# EAGLE design Attempt1 (EAGLE 9.6.2)
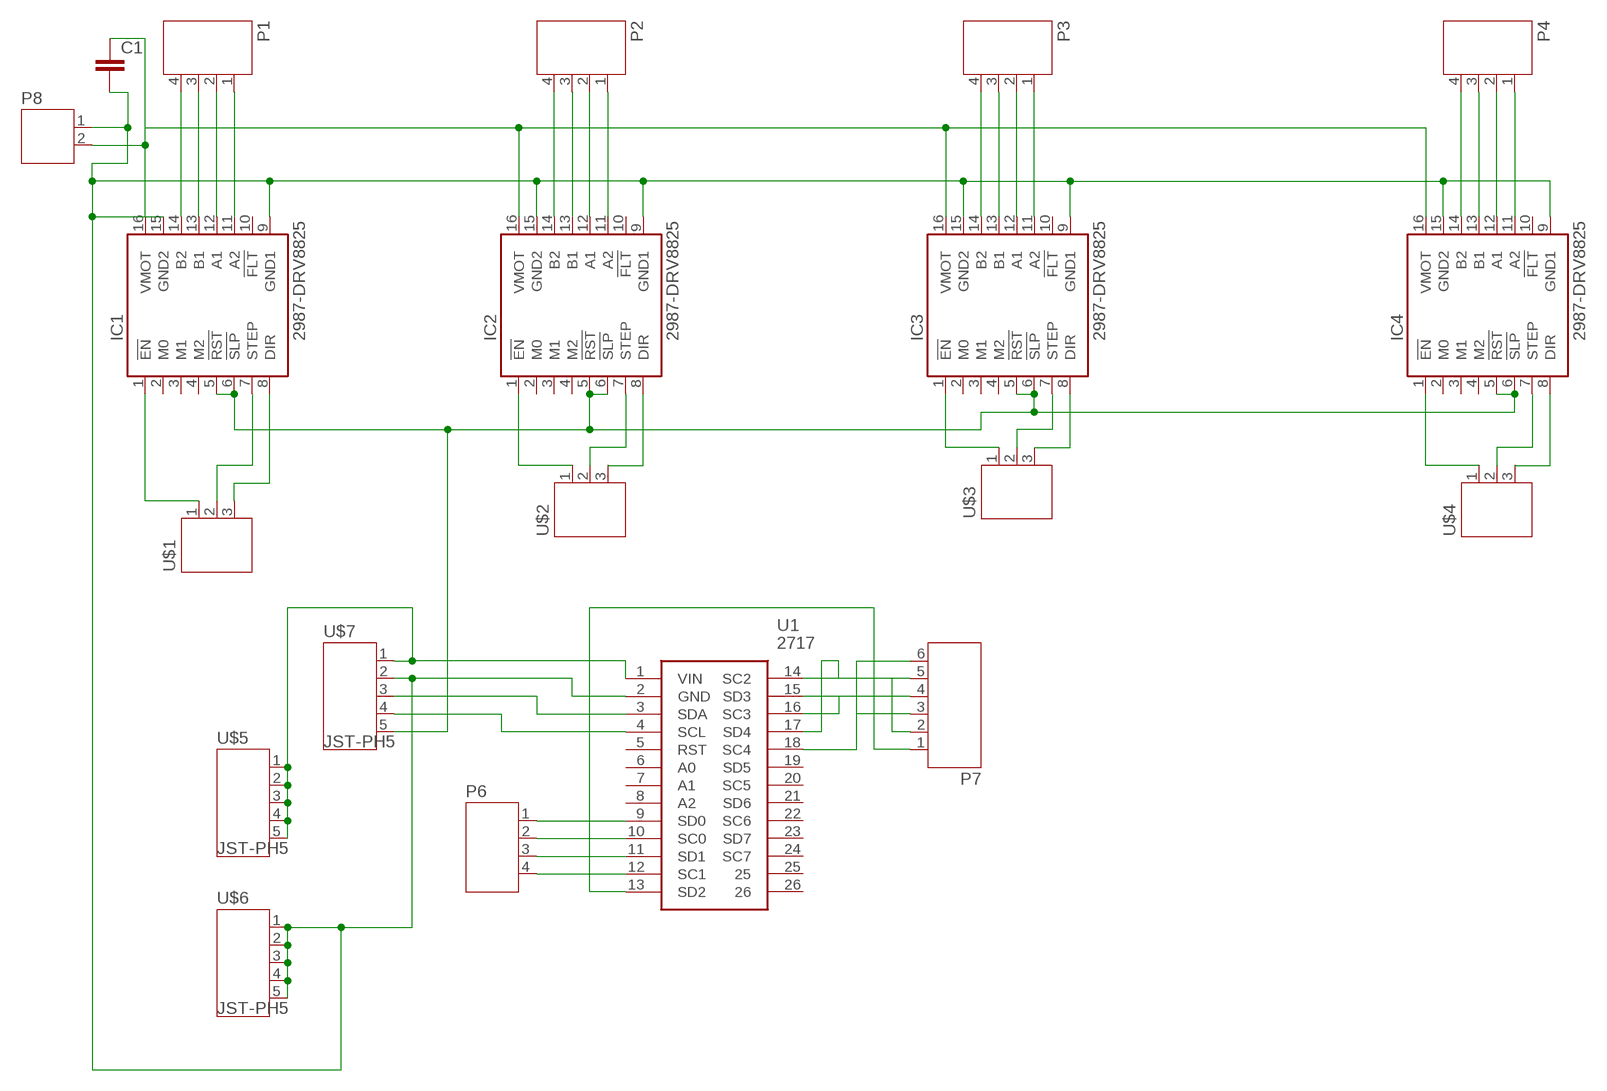
[diagram p0: schematic, sheet 1]

## Parts
C1  C2.5/4  [C2.5-4]
IC1  2987-DRV8825  [DRV8825]
IC2  2987-DRV8825  [DRV8825]
IC3  2987-DRV8825  [DRV8825]
IC4  2987-DRV8825  [DRV8825]
P1  JST-PH4  [JST-PH4]
P2  JST-PH4  [JST-PH4]
P3  JST-PH4  [JST-PH4]
P4  JST-PH4  [JST-PH4]
P6  JST-PH4  [JST-PH4]
P7  JST-PH6  [JST-PH6]
P8  JST-PH2  [JST-PH2]
U1  2717  [2717]
U$1  JST-PH3  [JST-PH3]
U$2  JST-PH3  [JST-PH3]
U$3  JST-PH3  [JST-PH3]
U$4  JST-PH3  [JST-PH3]
U$5  JST-PH5  [JST-PH5]
U$6  JST-PH5  [JST-PH5]
U$7  JST-PH5  [JST-PH5]

## Nets
N$1: IC1.14(B2) P1.4
N$2: IC1.13(B1) P1.3
N$3: IC1.12(A1) P1.2
N$4: IC1.11(A2) P1.1
N$5: IC2.14(B2) P2.4
N$6: IC2.13(B1) P2.3
N$7: IC2.12(A1) P2.2
N$8: IC2.11(A2) P2.1
N$9: IC3.11(A2) P3.1
N$10: IC3.12(A1) P3.2
N$11: IC3.13(B1) P3.3
N$12: IC3.14(B2) P3.4
N$13: IC4.14(B2) P4.4
N$14: IC4.13(B1) P4.3
N$15: IC4.12(A1) P4.2
N$16: IC4.11(A2) P4.1
N$17: IC4.8(DIR) U$4.3
N$18: IC4.7(STEP) U$4.2
N$19: IC4.1(!EN) U$4.1
N$20: IC1.5(!RST) IC1.6(!SLP) IC2.5(!RST) IC2.6(!SLP) IC3.5(!RST) IC3.6(!SLP) IC4.5(!RST) IC4.6(!SLP) U$7.5
N$21: P7.2 U1.14(SC2)
N$22: IC3.8(DIR) U$3.3
N$23: IC3.7(STEP) U$3.2
N$24: IC3.1(!EN) U$3.1
N$25: IC2.8(DIR) U$2.3
N$26: IC2.7(STEP) U$2.2
N$27: IC2.1(!EN) U$2.1
N$28: P7.3 U1.15(SD3)
N$29: C1.1 IC1.16(VMOT) IC2.16(VMOT) IC3.16(VMOT) IC4.16(VMOT) P8.2
N$30: IC1.8(DIR) U$1.3
N$31: IC1.7(STEP) U$1.2
N$32: IC1.1(!EN) U$1.1
N$33: P7.4 U1.16(SC3)
N$34: C1.2 IC1.9(GND1) IC1.15(GND2) IC2.9(GND1) IC2.15(GND2) IC3.9(GND1) IC3.15(GND2) IC4.9(GND1) IC4.15(GND2) P8.1 U1.2(GND) U$6.1 U$6.2 U$6.3 U$6.4 U$6.5 U$7.2
N$35: P6.1 U1.9(SD0)
N$36: P6.2 U1.10(SC0)
N$37: P6.3 U1.11(SD1)
N$38: P6.4 U1.12(SC1)
N$39: P7.5 U1.17(SD4)
N$40: P7.6 U1.18(SC4)
N$44: P7.1 U1.13(SD2)
N$47: U1.3(SDA) U$7.3
N$48: U1.4(SCL) U$7.4
N$49: U1.1(VIN) U$5.1 U$5.2 U$5.3 U$5.4 U$5.5 U$7.1
Unconnected: IC1.2(M0) IC1.3(M1) IC1.4(M2) IC1.10(!FLT) IC2.2(M0) IC2.3(M1) IC2.4(M2) IC2.10(!FLT) IC3.2(M0) IC3.3(M1) IC3.4(M2) IC3.10(!FLT) IC4.2(M0) IC4.3(M1) IC4.4(M2) IC4.10(!FLT) U1.5(RST) U1.6(A0) U1.7(A1) U1.8(A2) U1.19(SD5) U1.20(SC5) U1.21(SD6) U1.22(SC6) U1.23(SD7) U1.24(SC7) U1.25 U1.26

## Library data of the parts
C1 = capacitor-wima:C: CAPACITOR naming: grid - package width
IC1-IC4 = pololu-stepper-driver:2987-DRV8825: DRV8825 Stepper Motor Driver Carrier; High Current (Bulk; Header Pins Soldered) #2987 DRV8825 Stepper Motor Driver Carrier; High Current (Bulk; Header Pins Soldered) <https://www.pololu.com/product/2987> in Japan, Suzaku Lab. Ltd. <https://suzakugiken.jp/> #2987 DRV8825 大電流ステッピングモータドライバボード (バルク品 ピンヘッダ実装済み) <https://szc.jp/po2987>
P1-P4 P6 = jst-ph-k:JST-PH4
P7 = jst-ph-k:JST-PH6
P8 = jst-ph-k:JST-PH2
U1 = TCA9548A_m:2717: Switch IC Development Tools TCA9548A I2C Multiplexer Source: Datasheet <https://learn.adafruit.com/downloads/pdf/adafruit-tca9548a-1-to-8-i2c-multiplexer-breakout.pdf>; DESCRIPTION: Switch IC Development Tools TCA9548A I2C Multiplexer; HEIGHT: 1mm; MANUFACTURER_NAME: Adafruit; MANUFACTURER_PART_NUMBER: 2717; MOUSER_PART_NUMBER: 485-2717; MOUSER_PRICE-STOCK: https://www.mouser.com/Search/Refine.aspx?Keyword=485-2717
U$1-U$4 = jst-ph-k:JST-PH3
U$5-U$7 = jst-ph-k:JST-PH5

## Board
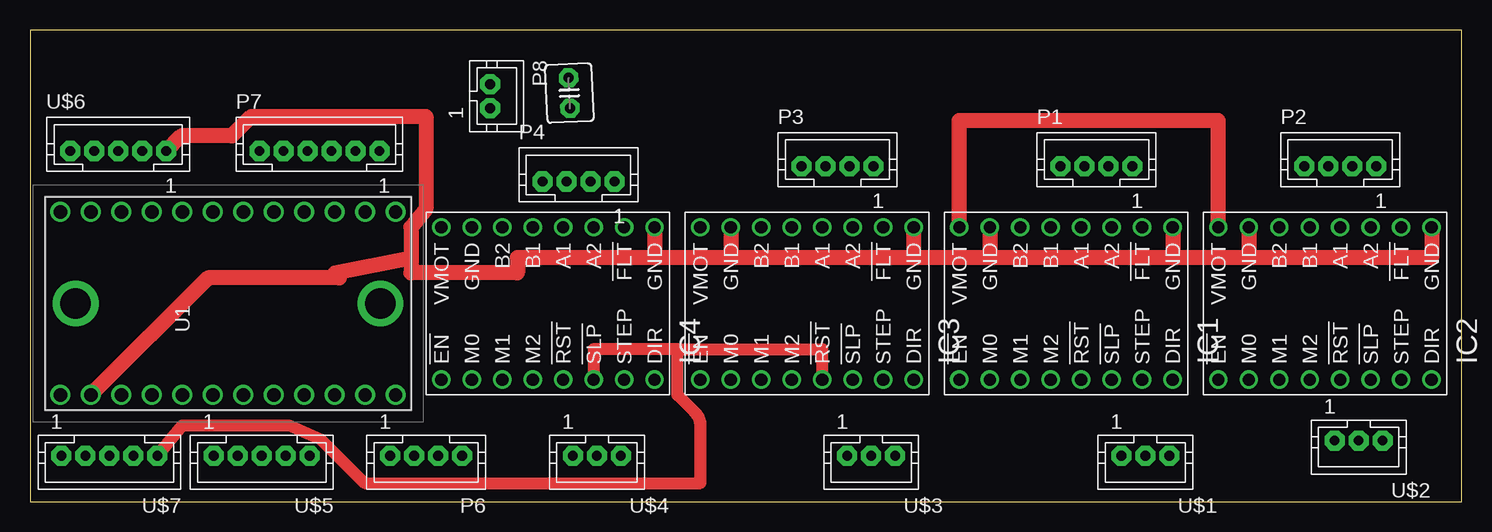
[diagram p1: board, top side]
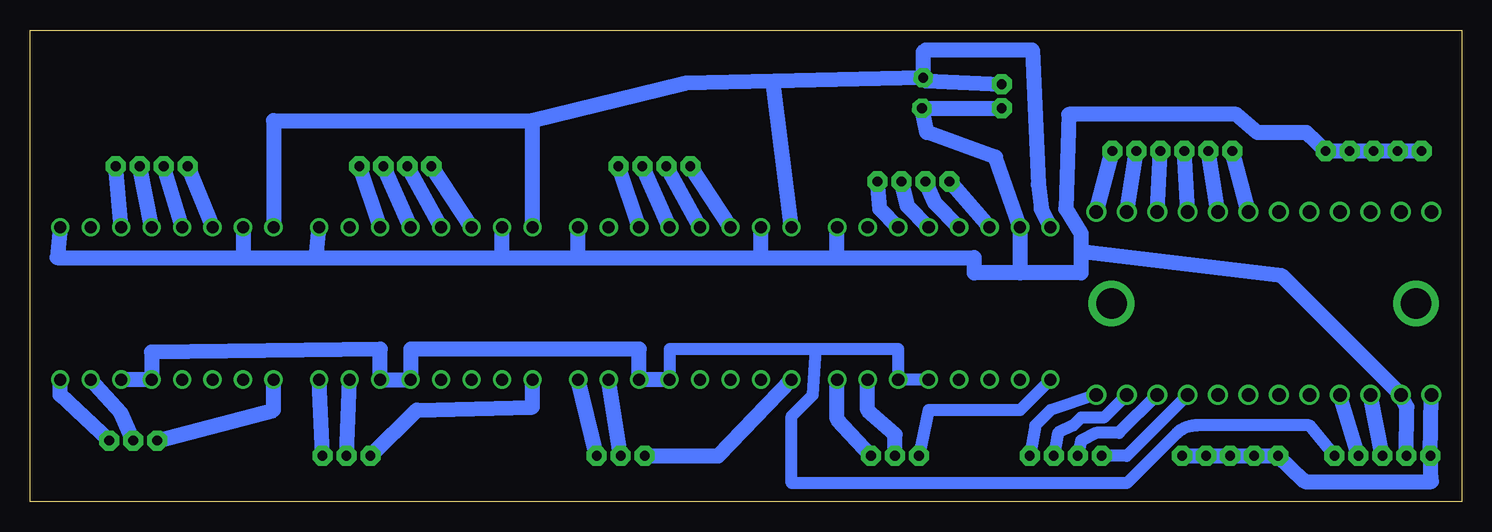
[diagram p2: board, bottom side, seen from below]

Size 119.36 x 39.29 mm. Coordinates in mm from the lower left corner, seen from the top.
Outline: 0,0 119.36,0 119.36,39.29 0,39.29 0,0
Copper layers (1*16): Top 0.035mm / dielectric 1.5mm / Bottom 0.035mm
Design rules "default": minimum track width 6mil, minimum drill 0.35mm, track to track 6mil, track to pad 6mil, pad to pad 6mil, via to via 6mil, smd to smd 6mil, copper to edge 40mil, drill to drill 6mil, minimum pad ring 10mil, minimum via ring 8mil, stop-mask expansion 4mil, vias tented up to drill 0mil, thermal gap 10mil

### Footprints (pad centres in the part's own frame; a part is rotated, then mirrored left to right if it is on the bottom)
C2.5-4 = drill 0.813 pad 1.6 octagon: 1 -1.27,0; 2 1.27,0
DRV8825 = drill 1.016: 1 -6.35,8.89; 2 -6.35,6.35; 3 -6.35,3.81; 4 -6.35,1.27; 5 -6.35,-1.27; 6 -6.35,-3.81; 7 -6.35,-6.35; 8 -6.35,-8.89; 9 6.35,-8.89; 10 6.35,-6.35; 11 6.35,-3.81; 12 6.35,-1.27; 13 6.35,1.27; 14 6.35,3.81; 15 6.35,6.35; 16 6.35,8.89
JST-PH4 = drill 0.813 pad 1.676 octagon: 1 3,0; 2 1,0; 3 -1,0; 4 -3,0
JST-PH6 = drill 0.813 pad 1.676 octagon: 1 5,0; 2 3,0; 3 1,0; 4 -1,0; 5 -3,0; 6 -5,0
JST-PH2 = drill 0.813 pad 1.676 octagon: 1 1,0; 2 -1,0
2717 = drill 1.11 pad 1.665: 1 -7.62,13.97; 2 -7.62,11.43; 3 -7.62,8.89; 4 -7.62,6.35; 5 -7.62,3.81; 6 -7.62,1.27; 7 -7.62,-1.27; 8 -7.62,-3.81; 9 -7.62,-6.35; 10 -7.62,-8.89; 11 -7.62,-11.43; 12 -7.62,-13.97; 13 7.62,-13.97; 14 7.62,-11.43; 15 7.62,-8.89; 16 7.62,-6.35; 17 7.62,-3.81; 18 7.62,-1.27; 19 7.62,1.27; 20 7.62,3.81; 21 7.62,6.35; 22 7.62,8.89; 23 7.62,11.43; 24 7.62,13.97 | drill 2.54 pad 3.81: 25 0,12.7; 26 0,-12.7
JST-PH3 = drill 0.813 pad 1.676 octagon: 1 3,0; 2 1,0; 3 -1,0
JST-PH5 = drill 0.813 pad 1.676 octagon: 1 5,0; 2 3,0; 3 1,0; 4 -1,0; 5 -3,0

### Placement (x,y rotation side)
C1  44.96,34.04 272.6 top
IC1  86.36,16.51 90 top
IC2  107.95,16.51 90 top
IC3  64.77,16.51 90 top
IC4  43.18,16.51 90 top
P1  88.9,27.94 0 top
P2  109.22,27.94 0 top
P3  67.31,27.94 0 top
P4  45.72,26.67 0 top
P6  33.02,3.81 180 top
P7  24.13,29.21 0 top
P8  38.35,33.78 270 top
U1  16.51,16.51 90 top
U$1  93.98,3.81 180 top
U$2  111.76,5.08 180 top
U$3  71.12,3.81 180 top
U$4  48.26,3.81 180 top
U$5  20.32,3.81 180 top
U$6  6.35,29.21 0 top
U$7  7.62,3.81 180 top

### Tracks (layer width: path | path; a pad name or v marks a point on that pad's centre or on a via)
N$1
  Bottom 1.27: IC1.14 P1.4
N$2
  Bottom 1.27: IC1.13 P1.3
N$3
  Bottom 1.27: IC1.12 P1.2
N$4
  Bottom 1.27: IC1.11 P1.1
N$5
  Bottom 1.27: P2.4 IC2.14
N$6
  Bottom 1.27: IC2.13 P2.3
N$7
  Bottom 1.27: IC2.12 P2.2
N$8
  Bottom 1.27: IC2.11 P2.1
N$9
  Bottom 1.27: IC3.11 P3.1
N$10
  Bottom 1.27: IC3.12 P3.2
N$11
  Bottom 1.27: IC3.13 P3.3
N$12
  Bottom 1.27: IC3.14 P3.4
N$13
  Bottom 1.27: IC4.14 P4.4
N$14
  Bottom 1.27: IC4.13 43.94,24.89 P4.3
N$15
  Bottom 1.27: IC4.12 46.23,24.64 P4.2
N$16
  Bottom 1.27: IC4.11 48.51,24.38 P4.1
N$17
  Bottom 1.27: U$4.3 52.07,6.86 IC4.8
N$18
  Bottom 1.27: U$4.2 47.24,5.59 49.53,7.62 IC4.7
N$19
  Bottom 1.016: IC4.1 36.83,7.62 44.45,7.62 U$4.1
N$20
  Top 1.016: U$7.5 12.7,6.35 21.59,6.35 24.24,5.19 27.91,1.52 55.88,1.52 55.88,6.35 arc45 55.43,7.43 53.98,8.89 53.98,12.7 | 53.98,12.7 46.99,12.7 IC4.6 | 53.98,12.7 66.04,12.7 IC3.5
  Bottom 1.016: U$7.5 12.7,6.35 22.06,6.35 arc-45 23.86,5.61 27.94,1.52 55.88,1.52 55.88,7.11 54.1,8.89 53.85,12.7 | 53.85,12.7 46.99,12.7 IC4.6 IC4.5 | 53.85,12.7 66.04,12.7 IC3.5
  Bottom 1.27: IC3.5 IC3.6 68.58,12.7 87.63,12.7 IC1.5 IC1.6 90.17,12.7 109.22,12.45 IC2.5 IC2.6
N$21
  Bottom 1.27: U1.14 P7.2
N$22
  Bottom 1.27: U$3.3 IC3.8
N$23
  Bottom 1.27: U$3.2 IC3.7
N$24
  Bottom 1.27: U$3.1 61.98,3.81 IC3.1
N$25
  Bottom 1.27: U$2.3 116.84,8.89 IC2.8
N$26
  Bottom 1.27: U$2.2 111.76,7.37 IC2.7
N$27
  Bottom 1.27: U$2.1 99.06,7.62 IC2.1
N$28
  Bottom 1.27: U1.15 P7.3
N$29
  Top 1.27: IC2.16 99.06,31.75 77.47,31.75 IC1.16
  Bottom 1.27: IC1.16 77.47,31.75 | 77.47,31.75 99.06,31.75 IC2.16 | C1.1 57.41,35.02 | 57.41,35.02 64.78,34.84 64.99,34.79 77.47,31.75 | C1.1 44.66,35.06 P8.2 | C1.1 44.9,37.45 44.7,37.64 35.81,37.64 35.31,26.42 35.05,24.38 IC4.16 | IC3.16 57.41,35.02
N$30
  Bottom 1.27: U$1.3 IC1.8
N$31
  Bottom 1.27: U$1.2 IC1.7
N$32
  Bottom 1.27: U$1.1 87.12,7.62 77.47,7.87 IC1.1
N$33
  Bottom 1.27: U1.16 P7.4
N$34
  Top 1.27: IC2.9 116.84,20.32 101.6,20.32 | IC2.15 101.6,20.32 | 101.6,20.32 95.25,20.32 | 95.25,20.32 80.01,20.32 | IC1.9 95.25,20.32 | IC1.15 80.01,20.32 | IC3.15 58.42,20.32 | 80.01,20.32 73.66,20.32 | 73.66,20.32 58.42,20.32 | IC3.9 73.66,20.32 | IC4.9 52.07,20.32 | 58.42,20.32 52.07,20.32 | 52.07,20.32 40.64,20.32 40.64,19.05 31.75,19.05 31.75,20.32 | U1.2 14.83,18.64 25.8,18.64 25.4,19.05 31.75,20.32 | U$6.1 12.62,30.48 16.83,30.48 18.46,32.11 33.02,32.11 33.02,24.38 31.75,22.86 31.75,20.32
  Bottom 1.27: U$7.2 4.57,7.87 U1.2 14.99,18.8 31.75,20.83 | U$6.5 U$6.4 U$6.3 U$6.2 U$6.1 12.95,30.73 17.02,30.73 18.8,32.26 32.77,32.26 33.02,24.38 31.75,22.35 31.75,20.83 | 31.75,20.83 31.75,19.05 36.83,19.05 | 36.83,19.05 40.64,19.05 40.64,20.32 52.07,20.32 | 101.6,20.32 117.09,20.32 IC2.9 | 101.6,20.32 95.5,20.32 | 95.5,20.32 80.01,20.32 | 80.01,20.32 73.66,20.32 | 73.66,20.32 58.42,20.32 | 58.42,20.32 52.07,20.32 | IC2.15 101.6,20.32 | 95.5,20.32 IC1.9 | 80.01,20.32 IC1.15 | 73.66,20.32 IC3.9 | 58.42,20.32 IC3.15 | 52.07,20.32 IC4.9 | 38.38,32.8 P8.1 38.69,32.77 C1.2 44.61,30.75 38.86,28.7 IC4.15 36.83,19.05
N$35
  Bottom 1.016: U1.9 27.94,3.81 P6.1
N$36
  Bottom 1.016: U1.10 28.57,5.71 30.48,5.71 31.75,5.08 P6.2
N$37
  Bottom 1.016: U1.11 29.84,6.99 31.75,6.99 32.38,6.35 33.66,5.71 P6.3
N$38
  Bottom 1.016: U1.12 34.29,7.62 35.56,6.35 P6.4
N$39
  Bottom 1.27: U1.17 P7.5
N$40
  Bottom 1.27: U1.18 P7.6
N$44
  Bottom 1.27: U1.13 P7.1
N$47
  Bottom 1.27: U$7.3 U1.3
N$48
  Bottom 1.27: U$7.4 U1.4
N$49
  Bottom 1.27: U$5.5 U$5.4 U$5.3 U$5.2 U$5.1 13.21,1.78 13.08,1.65 2.54,1.65 U$7.1 U1.1